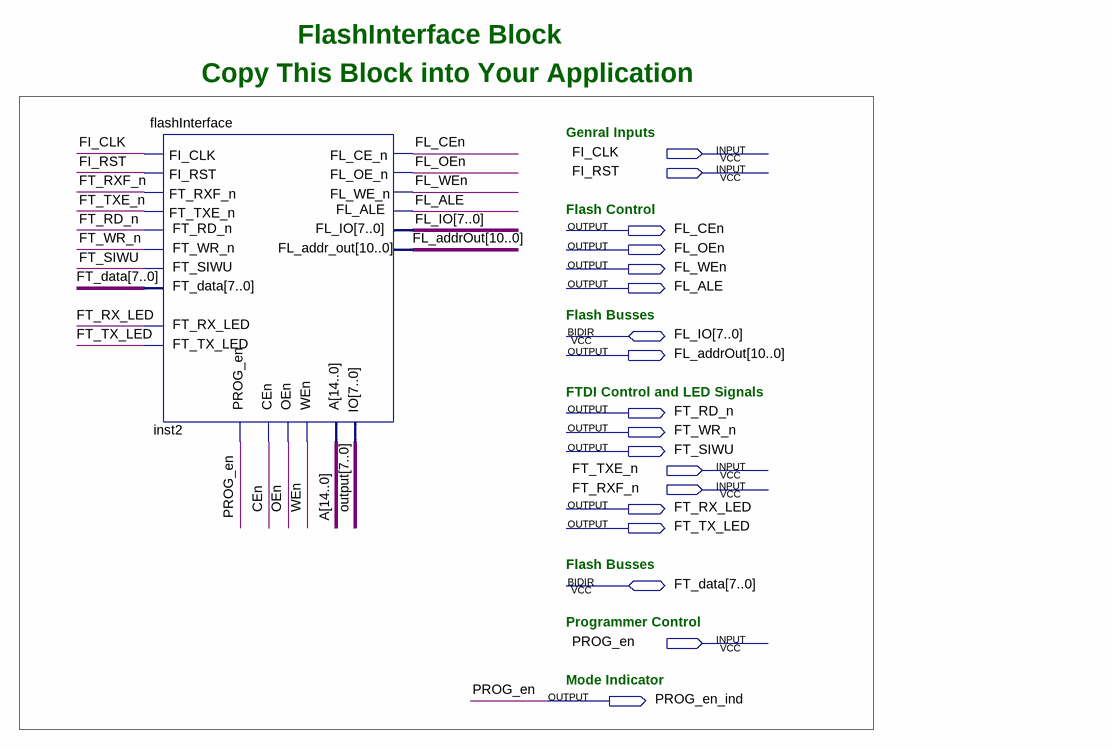
[diagram p0: schematic sheet]
// Quartus schematic FlashInterface_Block.bdf as structural Verilog: 1 symbols, 18 pins
module FlashInterface_Block (
  input  FI_CLK,
  input  FI_RST,
  input  FT_TXE_n,
  input  FT_RXF_n,
  input  PROG_en,
  inout  [7:0] FL_IO,
  inout  [7:0] FT_data,
  output FL_CEn,
  output FL_OEn,
  output FL_WEn,
  output FL_ALE,
  output [10:0] FL_addrOut,
  output FT_RD_n,
  output FT_WR_n,
  output FT_SIWU,
  output FT_RX_LED,
  output FT_TX_LED,
  output PROG_en_ind
);

  wire CEn, OEn, WEn;
  wire [7:0] \output ;
  wire [14:0] A;

  flashInterface inst2 (
    .FI_CLK(FI_CLK), .FI_RST(FI_RST), .FT_RXF_n(FT_RXF_n), .FT_TXE_n(FT_TXE_n), .PROG_en(PROG_en), .CEn(CEn),
    .OEn(OEn), .WEn(WEn), .A(A), .FT_RD_n(FT_RD_n), .FT_WR_n(FT_WR_n), .FT_SIWU(FT_SIWU), .FL_CE_n(FL_CEn),
    .FL_OE_n(FL_OEn), .FL_WE_n(FL_WEn), .FL_ALE(FL_ALE), .FT_RX_LED(FT_RX_LED), .FT_TX_LED(FT_TX_LED),
    .IO(\output ), .FL_addr_out(FL_addrOut), .FT_data(FT_data), .FL_IO(FL_IO));

  assign PROG_en_ind = PROG_en;

  // Notes on the sheet:
  //   FlashInterface Block   
  //   Copy This Block into Your Application
  //   Genral Inputs
  //   Flash Control
  //   Flash Busses
  //   FTDI Control and LED Signals
  //   Flash Busses
  //   Programmer Control
  //   Mode Indicator
endmodule
